# Altium schematic sheet SDRAM.SchDoc
size A4; SheetNumber: 3; SheetTotal: 10
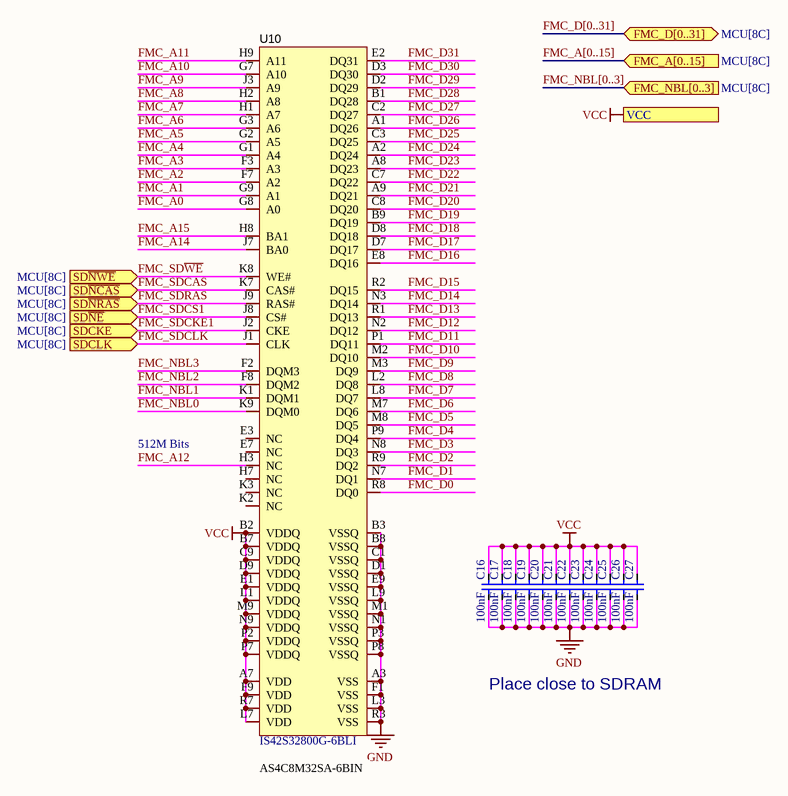
[diagram p0: SDRAM.SchDoc]

## Parts
C16  100nF  [0402-C]
C17  100nF  [0402-C]
C18  100nF  [0402-C]
C19  100nF  [0402-C]
C20  100nF  [0402-C]
C21  100nF  [0402-C]
C22  100nF  [0402-C]
C23  100nF  [0402-C]
C24  100nF  [0402-C]
C25  100nF  [0402-C]
C26  100nF  [0402-C]
C27  100nF  [0402-C]
U10  IS42S32800G-6BLI  [BGA-90_L13.0-W8.0-R6-C15-P0.80-TL]

## Ports
FMC_A[0..15] (in, see MCU[8C]), FMC_D[0..31] (bidir, see MCU[8C]), FMC_NBL[0..3] (in, see MCU[8C]), SDCKE (in, see MCU[8C]), SDCLK (in, see MCU[8C]), SD~{NCAS} (in, see MCU[8C]), SD~{NE} (in, see MCU[8C]), SD~{NRAS} (in, see MCU[8C]), SD~{NWE} (in, see MCU[8C]), VCC

## Nets
GND: C16.2 C17.2 C18.2 C19.2 C20.2 C21.2 C22.2 C23.2 C24.2 C25.2 C26.2 C27.2 U10.A3(VSS) U10.B3(VSSQ) U10.B8(VSSQ) U10.C1(VSSQ) U10.D1(VSSQ) U10.E9(VSSQ) U10.F1(VSS) U10.L3(VSS) U10.L9(VSSQ) U10.M1(VSSQ) U10.N1(VSSQ) U10.P3(VSSQ) U10.P8(VSSQ) U10.R3(VSS)
VCC: C16.1 C17.1 C18.1 C19.1 C20.1 C21.1 C22.1 C23.1 C24.1 C25.1 C26.1 C27.1 U10.A7(VDD) U10.B2(VDDQ) U10.B7(VDDQ) U10.C9(VDDQ) U10.D9(VDDQ) U10.E1(VDDQ) U10.F9(VDD) U10.L1(VDDQ) U10.L7(VDD) U10.M9(VDDQ) U10.N9(VDDQ) U10.P2(VDDQ) U10.P7(VDDQ) U10.R7(VDD) ; port VCC
FMC_A0: U10.G8(A0)
FMC_A1: U10.G9(A1)
FMC_A2: U10.F7(A2)
FMC_A3: U10.F3(A3)
FMC_A4: U10.G1(A4)
FMC_A5: U10.G2(A5)
FMC_A6: U10.G3(A6)
FMC_A7: U10.H1(A7)
FMC_A8: U10.H2(A8)
FMC_A9: U10.J3(A9)
FMC_A10: U10.G7(A10)
FMC_A11: U10.H9(A11)
FMC_A12: U10.H3(NC)
FMC_A14: U10.J7(BA0)
FMC_A15: U10.H8(BA1)
FMC_D0: U10.R8(DQ0)
FMC_D1: U10.N7(DQ1)
FMC_D2: U10.R9(DQ2)
FMC_D3: U10.N8(DQ3)
FMC_D4: U10.P9(DQ4)
FMC_D5: U10.M8(DQ5)
FMC_D6: U10.M7(DQ6)
FMC_D7: U10.L8(DQ7)
FMC_D8: U10.L2(DQ8)
FMC_D9: U10.M3(DQ9)
FMC_D10: U10.M2(DQ10)
FMC_D11: U10.P1(DQ11)
FMC_D12: U10.N2(DQ12)
FMC_D13: U10.R1(DQ13)
FMC_D14: U10.N3(DQ14)
FMC_D15: U10.R2(DQ15)
FMC_D16: U10.E8(DQ16)
FMC_D17: U10.D7(DQ17)
FMC_D18: U10.D8(DQ18)
FMC_D19: U10.B9(DQ19)
FMC_D20: U10.C8(DQ20)
FMC_D21: U10.A9(DQ21)
FMC_D22: U10.C7(DQ22)
FMC_D23: U10.A8(DQ23)
FMC_D24: U10.A2(DQ24)
FMC_D25: U10.C3(DQ25)
FMC_D26: U10.A1(DQ26)
FMC_D27: U10.C2(DQ27)
FMC_D28: U10.B1(DQ28)
FMC_D29: U10.D2(DQ29)
FMC_D30: U10.D3(DQ30)
FMC_D31: U10.E2(DQ31)
FMC_NBL0: U10.K9(DQM0)
FMC_NBL1: U10.K1(DQM1)
FMC_NBL2: U10.F8(DQM2)
FMC_NBL3: U10.F2(DQM3)
FMC_SD~{CAS}: U10.K7(CAS#) ; port SD~{NCAS}
FMC_SD~{CS}1: U10.J8(CS#) ; port SD~{NE}
FMC_SDCKE1: U10.J2(CKE) ; port SDCKE
FMC_SDCLK: U10.J1(CLK) ; port SDCLK
FMC_SD~{RAS}: U10.J9(RAS#) ; port SD~{NRAS}
FMC_SD~{WE}: U10.K8(WE#) ; port SD~{NWE}

Not connected (* = marked no-connect by the designer): U10 E3(NC) E7(NC) H7(NC) K2(NC) K3(NC)

## Buses and harness runs
bus FMC_A[0..15] = port FMC_A[0..15]
bus FMC_D[0..31] = port FMC_D[0..31]
bus FMC_NBL[0..3] = port FMC_NBL[0..3]

## Notes on the sheet
- 512M Bits
- Place close to SDRAM
- (near U10) AS4C8M32SA-6BIN

## Library data of the parts
C16-C27 = 电容-0402: Capacitor; Value: 0.1u
U10 = IS42S32800G-6BLI: Manufacturer: ISSI(美国芯成); Add into BOM: yes; Name: IS42S32800G-6BLI; Symbol: IS42S32800G-6BLI; Device: IS42S32800G-6BLI; LCSC Part Name: IS42S32800G-6BLI; Supplier Part: C2920767; Manufacturer Part: IS42S32800G-6BLI; Supplier Footprint: TFBGA-90(8x13); JLCPCB Part Class: Extended Part; Datasheet: https://atta.szlcsc.com/upload/public/pdf/source/20220614/2E4F120B9DE0CAEE6B87FE9099754B7F.pdf; Supplier: LCSC; Convert to PCB: yes